# EAGLE design act_pot_diff (EAGLE 9.5.2)

## Sheet 1 of 2
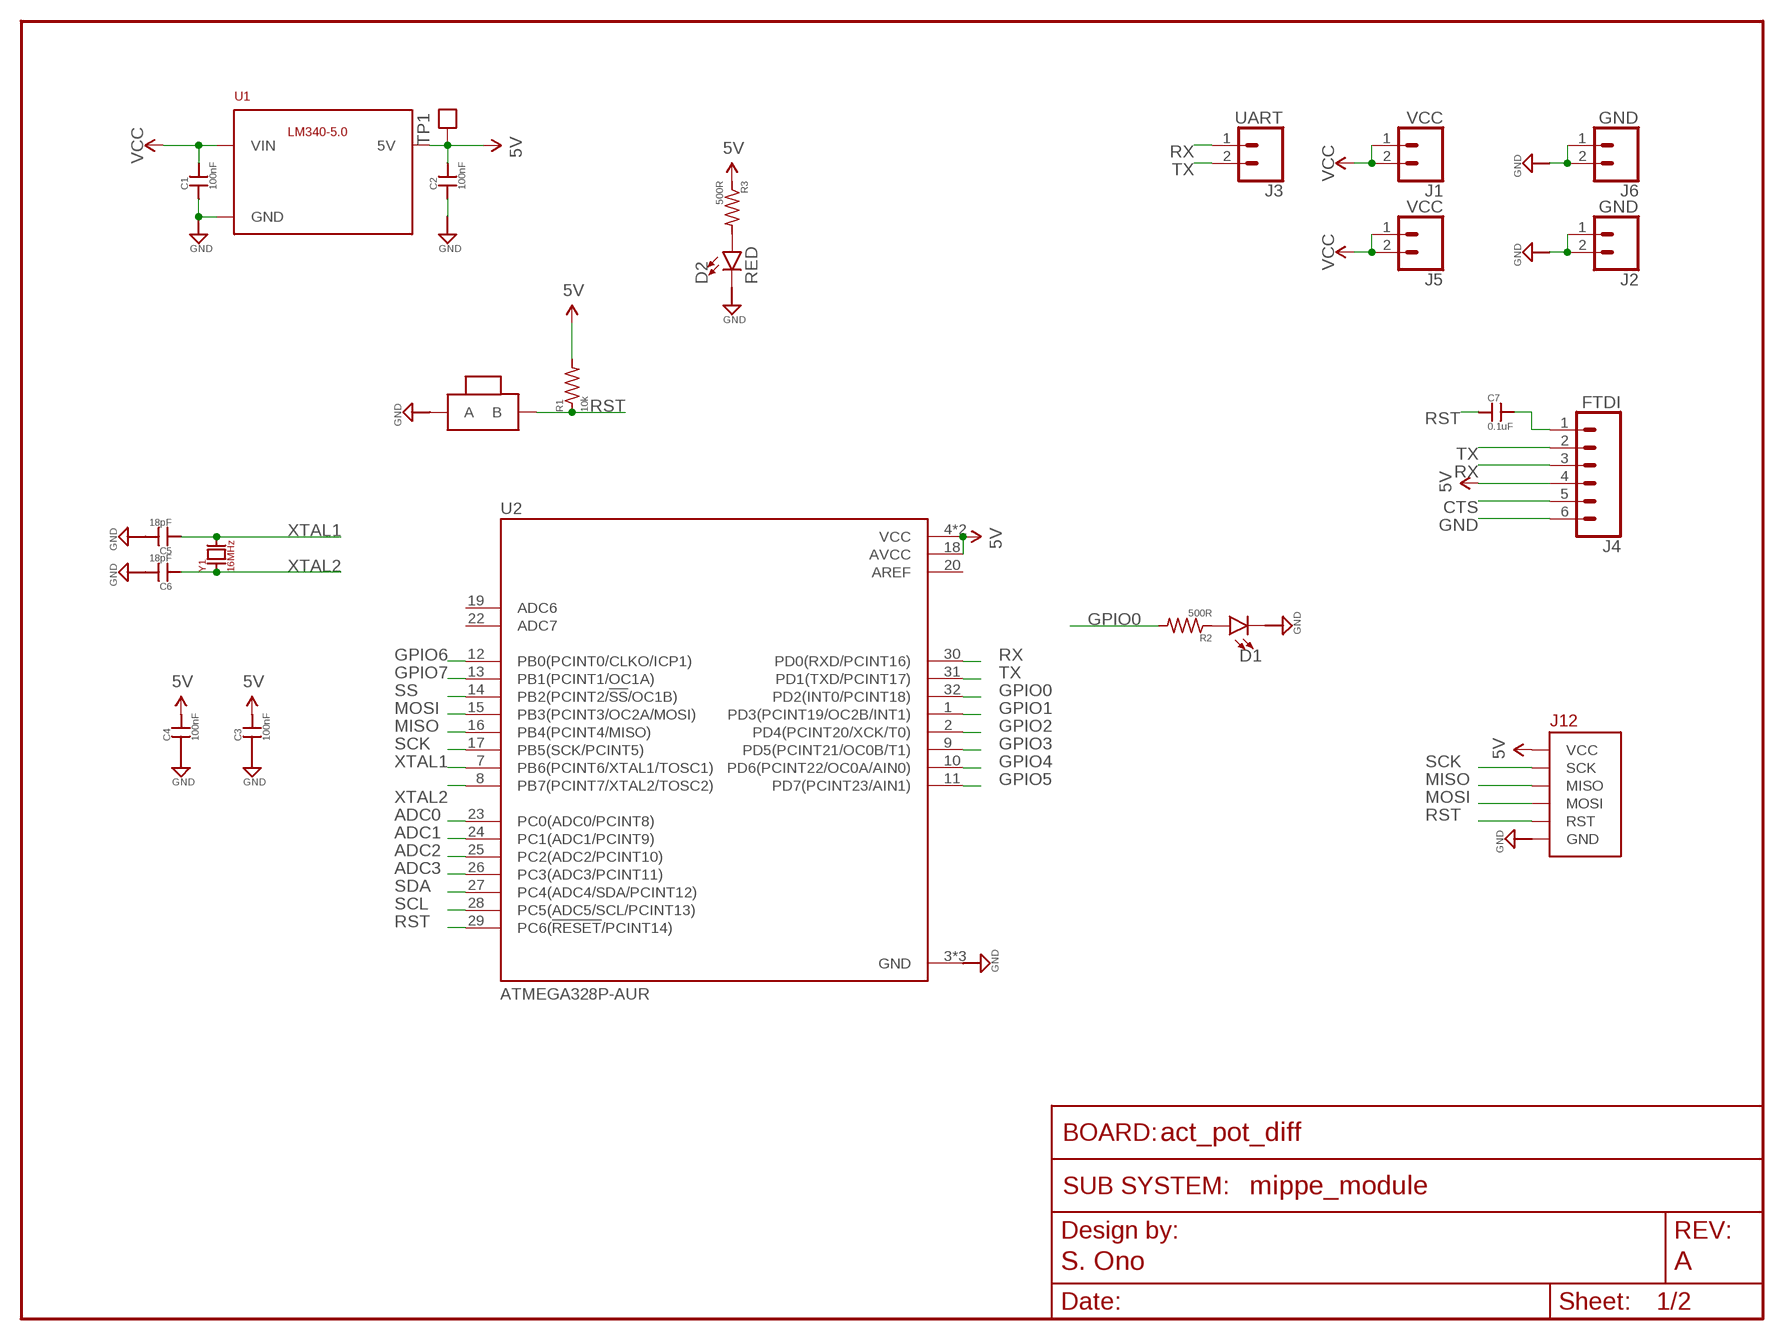
[diagram p0: schematic, sheet 1]
FRAME2 (FRAME_SCHEMATIC): AUTHOR: S. Ono; REV: A; SUBSYSTEM_NAME: mippe_module

### Parts
C1  100nF  CAP0402-CAP  [0402-CAP]
C2  100nF  CAP0402-CAP  [0402-CAP]
C3  100nF  CAP0402-CAP  [0402-CAP]
C4  100nF  CAP0402-CAP  [0402-CAP]
C5  18pF  CAP0402-CAP  [0402-CAP]
C6  18pF  CAP0402-CAP  [0402-CAP]
C7  0.1uF  CAP0402-CAP  [0402-CAP]
D1  LED0603  [LED-0603]
D2  RED  LED0603  [LED-0603]
J1  VCC  CONN_02  [1X02]
J2  GND  CONN_02  [1X02]
J3  UART  CONN_02  [1X02]
J4  FTDI  CONN_06NO_SILK_FEMALE_PTH  [1X06_NO_SILK]
J5  VCC  CONN_02  [1X02]
J6  GND  CONN_02  [1X02]
J12  BURNIN  [BURNIN]
R1  10k  R-US_R0402  [R0402]
R2  500R  R-US_R0402  [R0402]
R3  500R  R-US_R0402  [R0402]
SW1  BTN-PTS810  [BTN_PTS810]
TP1  TEST_POINTTHRU  [TEST_POINT]
U1  LM340MPX-5.0230  [SOT230P700X180-4N]
U2  ATMEGA328P-AUR  [QFP80P900X900X120-32N]
Y1  16MHz  CRYSTAL_SMOL  [XTAL500X320X130N]

### Nets
5V: C2.2 C3.2 C4.2 J4.4 J12.3.3V(VCC) R1.2 R3.1 TP1.1 U1.3(5V) U2.4(VCC) U2.6(VCC) U2.18(AVCC) ; also sheet 2
ADC0: U2.23(PC0(ADC0/PCINT8))
ADC1: U2.24(PC1(ADC1/PCINT9))
ADC2: U2.25(PC2(ADC2/PCINT10))
ADC3: U2.26(PC3(ADC3/PCINT11))
CTS: J4.5
GND: C1.1 C2.1 C3.1 C4.1 C5.2 C6.2 D1.C D2.C J2.1 J2.2 J4.6 J6.1 J6.2 J12.GND SW1.1(A) SW1.2(A) U1.2(GND) U1.4(GND) U2.3(GND) U2.5(GND) U2.21(GND) ; also sheet 2
GPIO0: R2.2 U2.32(PD2(INT0/PCINT18))
GPIO1: U2.1(PD3(PCINT19/OC2B/INT1))
GPIO2: U2.2(PD4(PCINT20/XCK/T0))
GPIO3: U2.9(PD5(PCINT21/OC0B/T1))
GPIO4: U2.10(PD6(PCINT22/OC0A/AIN0))
GPIO5: U2.11(PD7(PCINT23/AIN1))
GPIO6: U2.12(PB0(PCINT0/CLKO/ICP1))
GPIO7: U2.13(PB1(PCINT1/OC1A))
MISO: J12.MISO U2.16(PB4(PCINT4/MISO))
MOSI: J12.MOSI U2.15(PB3(PCINT3/OC2A/MOSI))
N$3: D1.A R2.1
N$4: D2.A R3.2
N$5: C7.2 J4.1
RST: C7.1 J12.RST R1.1 SW1.3(B) SW1.4(B) U2.29(PC6(!RESET!/PCINT14))
RX: J3.1 J4.3 U2.30(PD0(RXD/PCINT16))
SCK: J12.SCK U2.17(PB5(SCK/PCINT5))
SCL: U2.28(PC5(ADC5/SCL/PCINT13)) ; also sheet 2
SDA: U2.27(PC4(ADC4/SDA/PCINT12)) ; also sheet 2
SS: U2.14(PB2(PCINT2/!SS!/OC1B))
TX: J3.2 J4.2 U2.31(PD1(TXD/PCINT17))
VCC: C1.2 J1.1 J1.2 J5.1 J5.2 U1.1(VIN)
XTAL1: C5.1 U2.7(PB6(PCINT6/XTAL1/TOSC1)) Y1.2(B)
XTAL2: C6.1 U2.8(PB7(PCINT7/XTAL2/TOSC2)) Y1.1(A)
Unconnected: U2.19(ADC6) U2.22(ADC7)

## Sheet 2 of 2
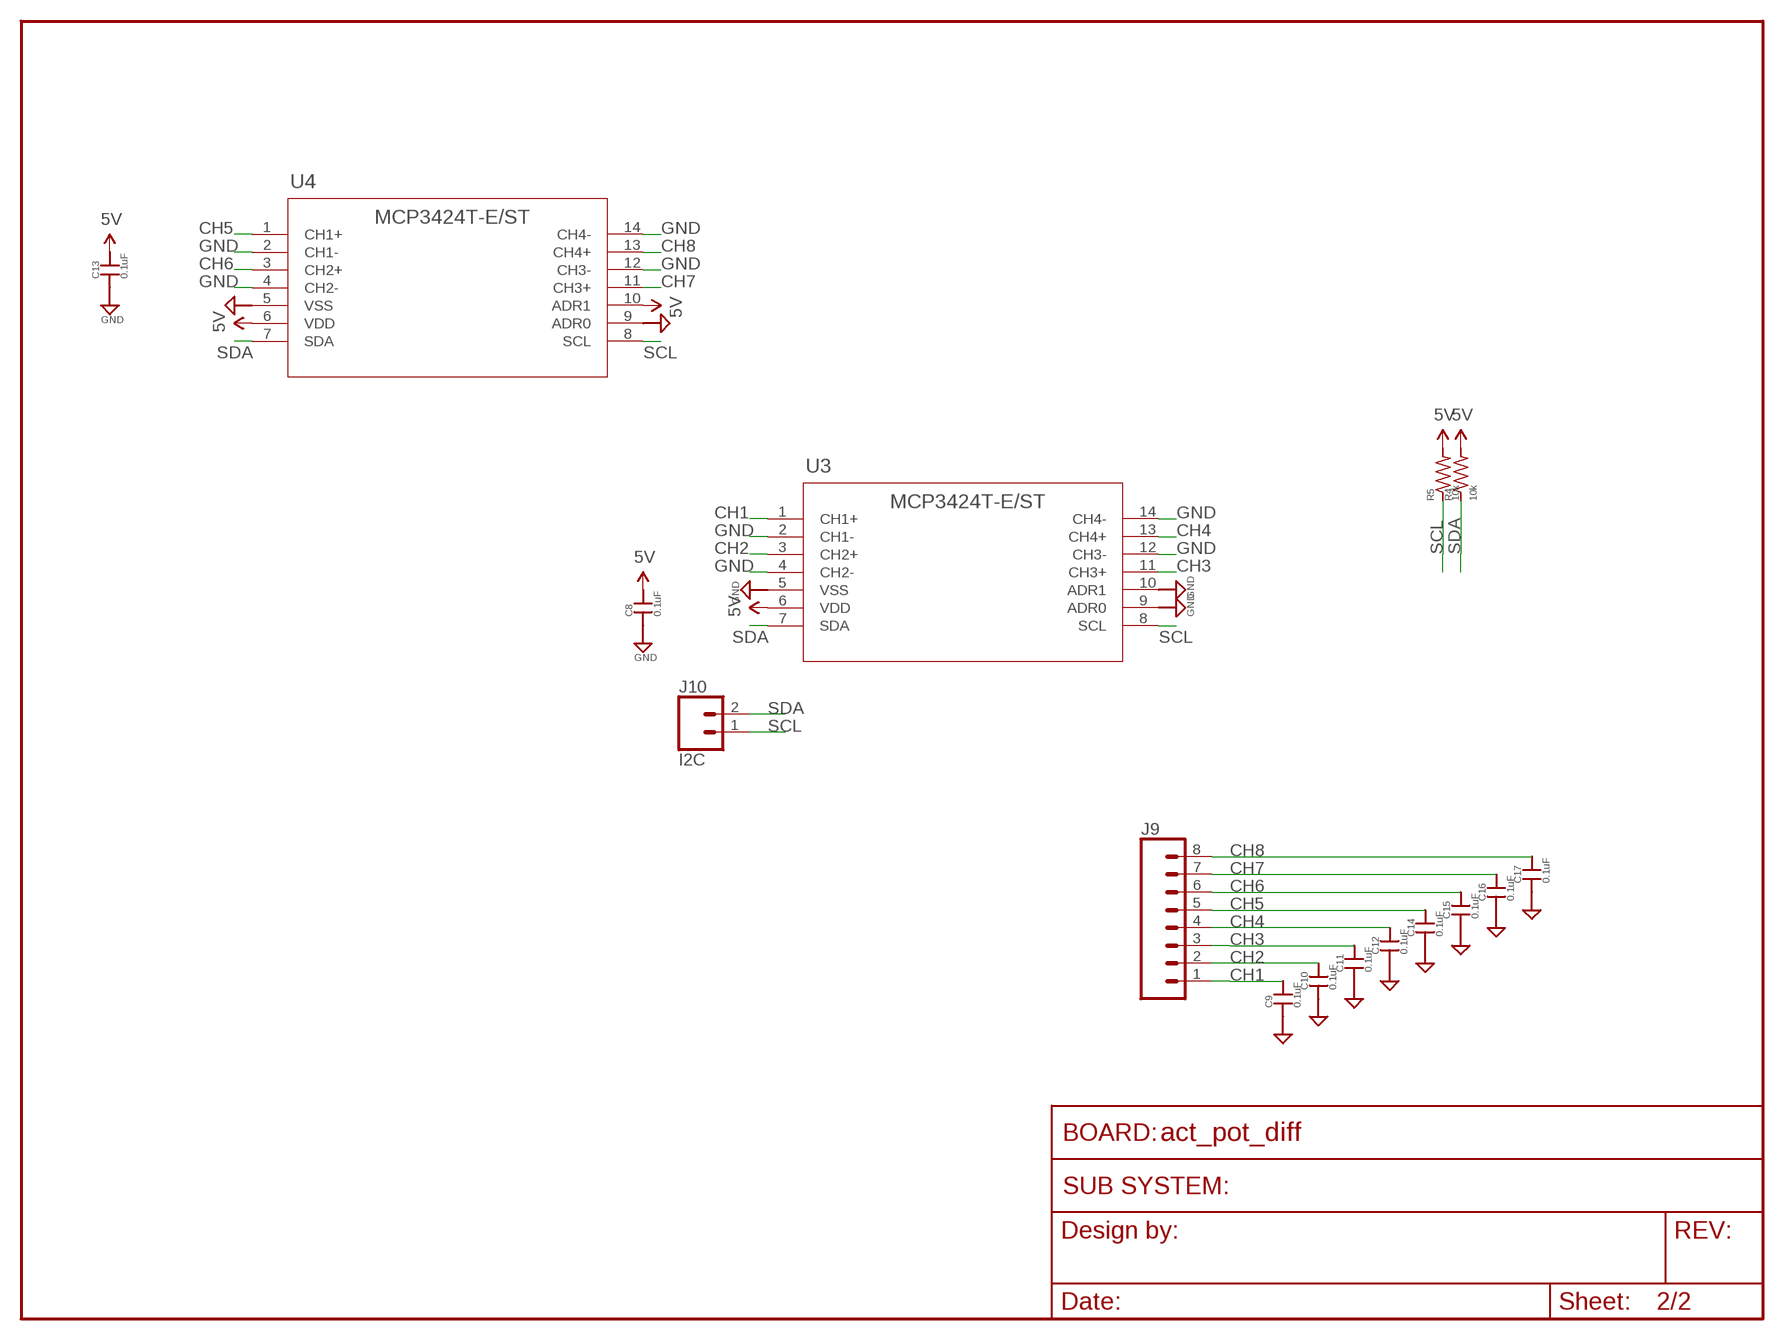
[diagram p1: schematic, sheet 2]

### Parts
C8  0.1uF  CAP0603-CAP  [0603-CAP]
C9  0.1uF  CAP0402-CAP  [0402-CAP]
C10  0.1uF  CAP0402-CAP  [0402-CAP]
C11  0.1uF  CAP0402-CAP  [0402-CAP]
C12  0.1uF  CAP0402-CAP  [0402-CAP]
C13  0.1uF  CAP0603-CAP  [0603-CAP]
C14  0.1uF  CAP0402-CAP  [0402-CAP]
C15  0.1uF  CAP0402-CAP  [0402-CAP]
C16  0.1uF  CAP0402-CAP  [0402-CAP]
C17  0.1uF  CAP0402-CAP  [0402-CAP]
J9  CONN_08"  [1X08]
J10  I2C  CONN_02  [1X02]
R4  10k  R-US_R0402  [R0402]
R5  10k  R-US_R0402  [R0402]
U3  MCP3424T-E/ST  [TSSOP14_MC]
U4  MCP3424T-E/ST  [TSSOP14_MC]

### Nets
5V: C8.2 C13.2 R4.2 R5.2 U3.6(VDD) U4.6(VDD) U4.10(ADR1) ; also sheet 1
CH1: C9.2 J9.1 U3.1(CH1+)
CH2: C10.2 J9.2 U3.3(CH2+)
CH3: C11.2 J9.3 U3.11(CH3+)
CH4: C12.2 J9.4 U3.13(CH4+)
CH5: C14.2 J9.5 U4.1(CH1+)
CH6: C15.2 J9.6 U4.3(CH2+)
CH7: C16.2 J9.7 U4.11(CH3+)
CH8: C17.2 J9.8 U4.13(CH4+)
GND: C8.1 C9.1 C10.1 C11.1 C12.1 C13.1 C14.1 C15.1 C16.1 C17.1 U3.2(CH1-) U3.4(CH2-) U3.5(VSS) U3.9(ADR0) U3.10(ADR1) U3.12(CH3-) U3.14(CH4-) U4.2(CH1-) U4.4(CH2-) U4.5(VSS) U4.9(ADR0) U4.12(CH3-) U4.14(CH4-) ; also sheet 1
SCL: J10.1 R5.1 U3.8(SCL) U4.8(SCL) ; also sheet 1
SDA: J10.2 R4.1 U3.7(SDA) U4.7(SDA) ; also sheet 1

## Power pins joined to a net without a drawn wire
AREF: U2.20(AREF)

## Library data of the parts
C1-C17 = scono:CAP: Capacitor Standard 0603 ceramic capacitor, and 0.1" leaded capacitor.; PIE-INT-REF-NUM: CAPACITOR-GENERIC
D1 D2 = scono:LED: https://www.digikey.com/products/en/optoelectronics/led-indication-discrete/105?k=&pkeyword=&pv7=2&pv1989=0&pv16=5&FV=ffe00069&quantity=0&ColumnSort=0&page=1&pageSize=25
J1-J3 J5 J6 J10 = scono:CONN_02: Multi connection point. Often used as Generic Header-pin footprint for 0.1 inch spaced/style header connections On any of the 0.1 inch spaced packages, you can populate with these: Break Away Headers - Straight <https://www.sparkfun.com/products/116> (PRT-00116) Break Away Male Headers - Right Angle <https://www.sparkfun.com/products/553> (PRT-00553) Female Headers <https://www.sparkfun.com/products/115> (PRT-00115) Break Away Headers - Machine Pin <https://www.sparkfun.com/products/117> (PRT-00117) Break Away Female Headers - Swiss Machine Pin <https://www.sparkfun.com/products/743> (PRT-00743) For SCREWTERMINALS and SPRING TERMINALS visit here: Screw Terimnals on SparkFun.com <https://www.sparkfun.com/search/results?term=Screw+Terminals> (5mm/3.5mm/2.54mm spacing) This device is also useful as a general connection point to wire up your design to another part of your project. Our various solder wires solder well into these plated through hole pads. Hook-Up Wire - Assortment (Stranded, 22 AWG) <https://www.sparkfun.com/products/11375> (PRT-11375) Hook-Up Wire - Assortment (Solid Core, 22 AWG) <https://www.sparkfun.com/products/11367> (PRT-11367) View the entire wire category on our website here <https://www.sparkfun.com/categories/141> Special notes: Molex polarized connector foot print use with: PRT-08233 with associated crimp pins and housings. 2.54_SCREWTERM for use with PRT-10571. 3.5mm Screw Terminal footprints for PRT-08084 5mm Screw Terminal footprints for use with PRT-08432
J4 = scono:CONN_06: Multi connection point. Often used as Generic Header-pin footprint for 0.1 inch spaced/style header connections On any of the 0.1 inch spaced packages, you can populate with these: Break Away Headers - Straight <https://www.sparkfun.com/products/116> (PRT-00116) Break Away Male Headers - Right Angle <https://www.sparkfun.com/products/553> (PRT-00553) Female Headers <https://www.sparkfun.com/products/115> (PRT-00115) Break Away Headers - Machine Pin <https://www.sparkfun.com/products/117> (PRT-00117) Break Away Female Headers - Swiss Machine Pin <https://www.sparkfun.com/products/743> (PRT-00743) Arduino Stackable Header - 6 Pin <https://www.sparkfun.com/products/9280> (PRT-09280) For SCREWTERMINALS and SPRING TERMINALS visit here: Screw Terimnals on SparkFun.com <https://www.sparkfun.com/search/results?term=Screw+Terminals> (5mm/3.5mm/2.54mm spacing) This device is also useful as a general connection point to wire up your design to another part of your project. Our various solder wires solder well into these plated through hole pads. Hook-Up Wire - Assortment (Stranded, 22 AWG) <https://www.sparkfun.com/products/11375> (PRT-11375) Hook-Up Wire - Assortment (Solid Core, 22 AWG) <https://www.sparkfun.com/products/11367> (PRT-11367) View the entire wire category on our website here <https://www.sparkfun.com/categories/141>; PROD_ID: CONN-08437
J9 = scono:CONN_08: Multi connection point. Often used as Generic Header-pin footprint for 0.1 inch spaced/style header connections On any of the 0.1 inch spaced packages, you can populate with these: Break Away Headers - Straight <https://www.sparkfun.com/products/116> (PRT-00116) Break Away Male Headers - Right Angle <https://www.sparkfun.com/products/553> (PRT-00553) Female Headers <https://www.sparkfun.com/products/115> (PRT-00115) Break Away Headers - Machine Pin <https://www.sparkfun.com/products/117> (PRT-00117) Break Away Female Headers - Swiss Machine Pin <https://www.sparkfun.com/products/743> (PRT-00743) Arduino Stackable Header - 8 Pin <https://www.sparkfun.com/products/9279> (PRT-09279) For SCREWTERMINALS and SPRING TERMINALS visit here: Screw Terimnals on SparkFun.com <https://www.sparkfun.com/search/results?term=Screw+Terminals> (5mm/3.5mm/2.54mm spacing) This device is also useful as a general connection point to wire up your design to another part of your project. Our various solder wires solder well into these plated through hole pads. Hook-Up Wire - Assortment (Stranded, 22 AWG) <https://www.sparkfun.com/products/11375> (PRT-11375) Hook-Up Wire - Assortment (Solid Core, 22 AWG) <https://www.sparkfun.com/products/11367> (PRT-11367) View the entire wire category on our website here <https://www.sparkfun.com/categories/141> Special notes: Molex polarized connector foot print use with SKU : PRT-08231 with associated crimp pins and housings. 1MM SMD Version SKU: PRT-10208 NOTES ON THE VARIANTS LOCK and LOCK_LONGPADS... This footprint was designed to help hold the alignment of a through-hole component (i.e. 6-pin header) while soldering it into place. You may notice that each hole has been shifted either up or down by 0.005 of an inch from it's more standard position (which is a perfectly straight line). This slight alteration caused the pins (the squares in the middle) to touch the edges of the holes. Because they are alternating, it causes a "brace" to hold the component in place. 0.005 has proven to be the perfect amount of "off-center" position when using our standard breakaway headers. Although looks a little odd when you look at the bare footprint, once you have a header in there, the alteration is very hard to notice. Also,if you push a header all the way into place, it is covered up entirely on the bottom side.; PROD_ID: CONN-08438
J12 = scono:BURNIN
R1-R5 = scono:R-US_: RESISTOR, American symbol
SW1 = scono:BTN-PTS810: https://www.digikey.com/product-detail/en/c-k/PTS810-SJM-250-SMTR-LFS/CKN10502CT-ND/4176673
TP1 = scono:TEST_POINT: 1206 Test point for O-scope probes. For A106146CT-ND or similar
U1 = scono:LM340MPX-5.0
U2 = scono:ATMEGA328P-AUR: ATmega328P Series 8 Bit 2 kB RAM 32 kB Flash SMT Microcontroller - TQFP-32; DESCRIPTION: ATmega328P Series 8 Bit 2 kB RAM 32 kB Flash SMT Microcontroller - TQFP-32; DIGI-KEY_PART_NUMBER: ATMEGA328P-AURCT-ND; DIGI-KEY_PURCHASE_URL: https://www.digikey.com/product-detail/en/microchip-technology/ATMEGA328P-AUR/ATMEGA328P-AURCT-ND/3789455?utm_source=snapeda&utm_medium=aggregator&utm_campaign=symbol; MF: Microchip; MP: ATMEGA328P-AUR; PACKAGE: TQFP-32 Microchip
U3 U4 = scono:MCP3424T-E/ST; MANUFACTURER_PART_NUMBER: MCP3424TEST; VENDOR: Microchip
Y1 = scono:CRYSTAL

## Board
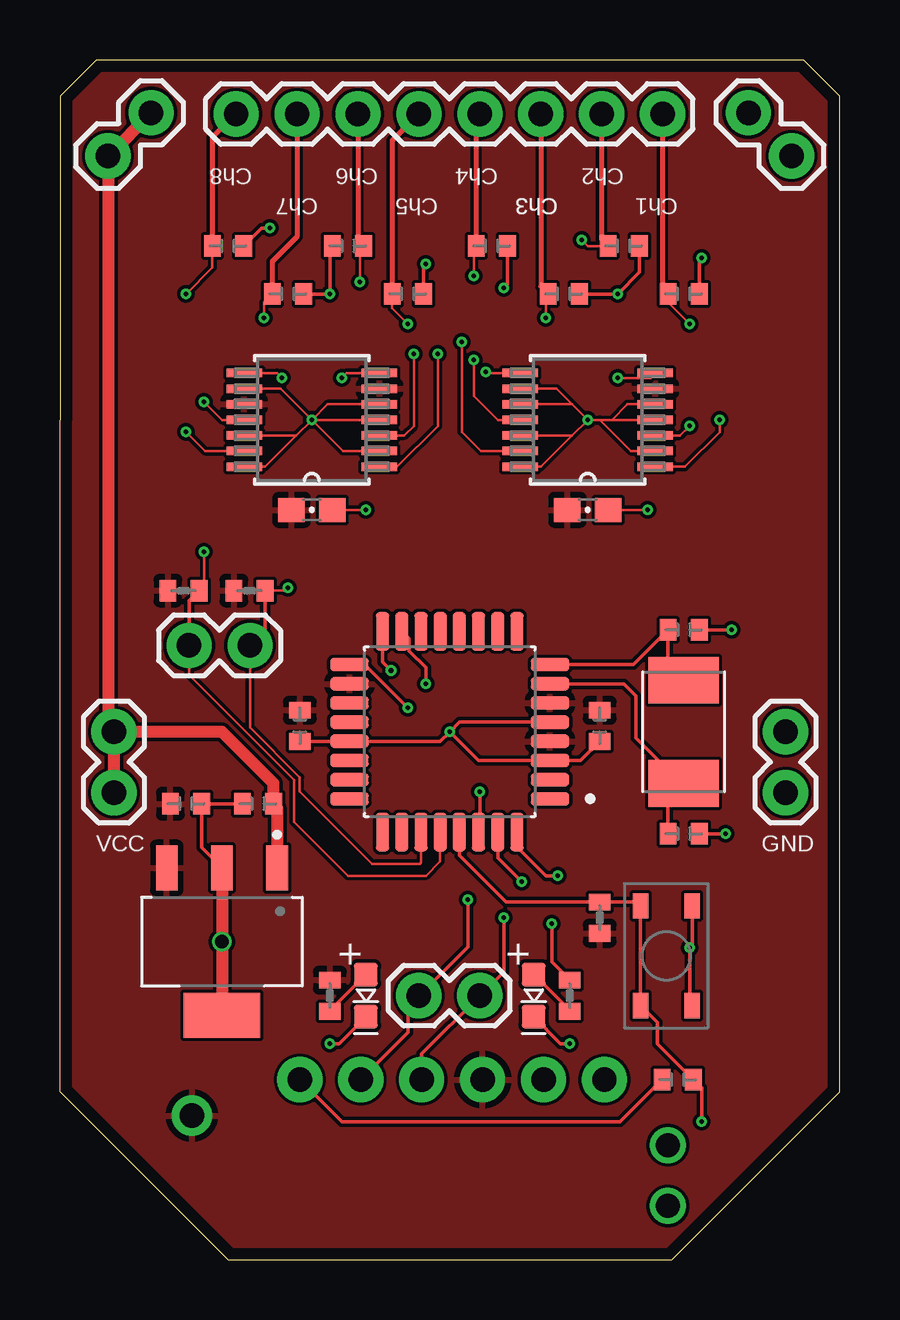
[diagram p2: board, top side]
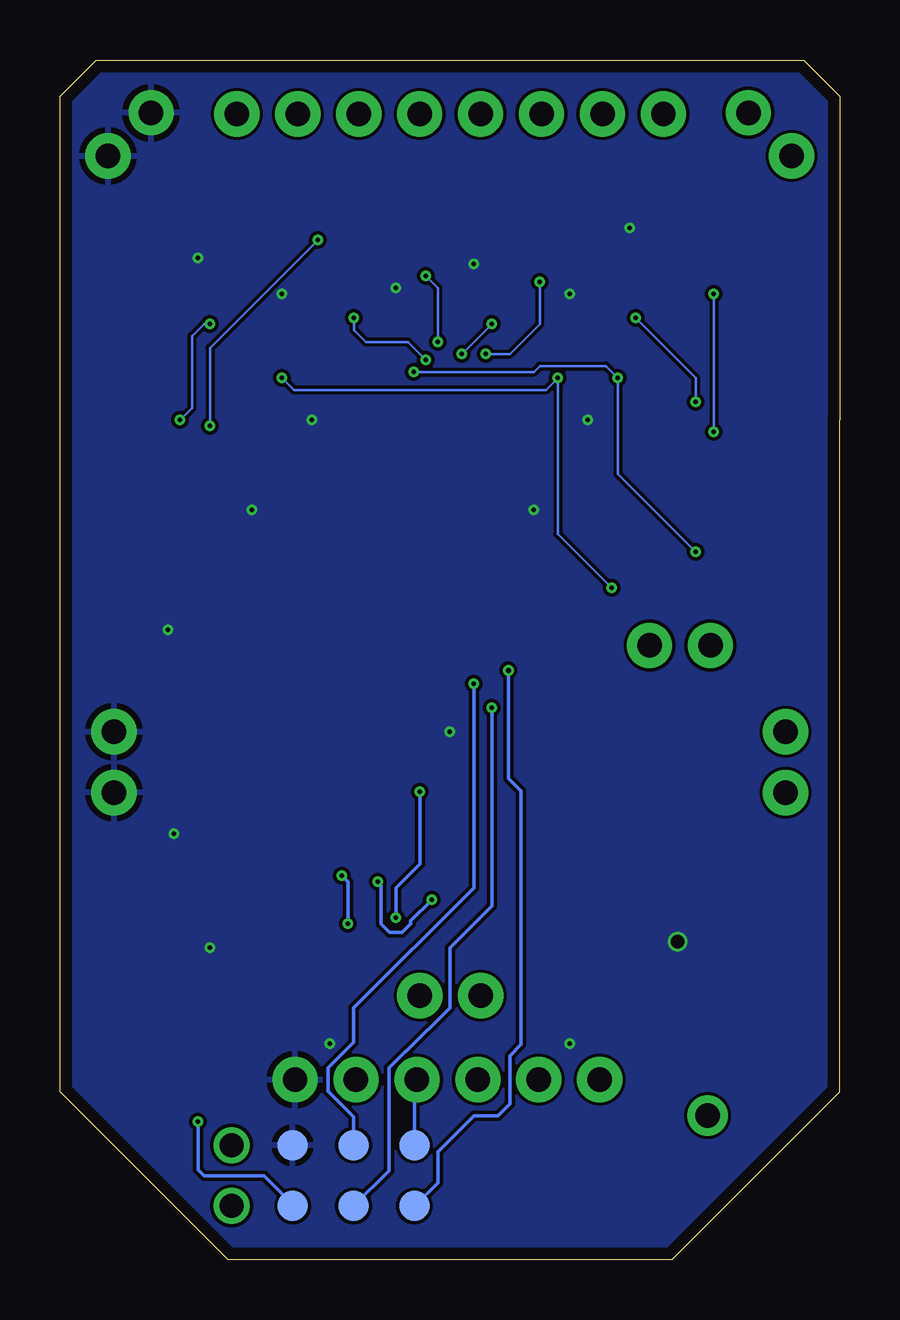
[diagram p3: board, bottom side, seen from below]

Size 32.5 x 50 mm. Coordinates in mm from the lower left corner, seen from the top.
Outline: 7,0 0,7 0,35 0,48.5 1.5,50 31,50 32.5,48.5 32.5,30.5 32.5,7 25.5,0 7,0
Copper layers (1*16): Top 2mil / dielectric 9mil / Bottom 2mil
Design rules "scono *": minimum track width 3.5mil, minimum drill 0.2mm, track to track 5.5mil, track to pad 5.5mil, pad to pad 5.5mil, via to via 5.5mil, smd to smd 0mil, copper to edge 0.5mm, drill to drill 0.5mm, minimum pad ring 0.125mm, minimum via ring 0.125mm, stop-mask expansion 3mil, vias tented up to drill 0mil, thermal gap 10mil

### Footprints (pad centres in the part's own frame; a part is rotated, then mirrored left to right if it is on the bottom)
0402-CAP = smd 0.7 x 0.9: 1 -0.65,0; 2 0.65,0
0603-CAP = smd 1.1 x 1: 1 -0.85,0; 2 0.85,0
LED-0603 = smd 1 x 1: A 0.877,0; C -0.877,0
1X02 = drill 1.016 pad 1.88: 1 0,0; 2 2.54,0
1X06_NO_SILK = drill 1.016 pad 1.88: 1 0,0; 2 2.54,0; 3 5.08,0; 4 7.62,0; 5 10.16,0; 6 12.7,0
1X08 = drill 1.016 pad 1.88: 1 0,0; 2 2.54,0; 3 5.08,0; 4 7.62,0; 5 10.16,0; 6 12.7,0; 7 15.24,0; 8 17.78,0
BURNIN = smd 1.27 x 1.27 bottom: 3.3V 0,0; GND -5.08,0; MISO 0,2.54; MOSI -2.54,0; RST -5.08,2.54; SCK -2.54,2.54 | drill 1: P$7 -7.62,2.54; P$8 -7.62,0
R0402 = smd 0.7 x 0.9: 1 -0.65,0; 2 0.65,0
BTN_PTS810 = smd 1.05 x 0.65: 1 -2.075,1.075; 2 2.075,1.075; 3 -2.075,-1.075; 4 2.075,-1.075
TEST_POINT = drill 1.016 pad 1.676: 1 0,0
SOT230P700X180-4N = smd 1.86 x 0.9: 1 -3.075,2.3; 2 -3.075,0; 3 -3.075,-2.3 | smd 1.86 x 3.19: 4 3.075,0
QFP80P900X900X120-32N = smd 1.6 x 0.55: 1 -4.18,2.8; 2 -4.18,2; 3 -4.18,1.2; 4 -4.18,0.4; 5 -4.18,-0.4; 6 -4.18,-1.2; 7 -4.18,-2; 8 -4.18,-2.8; 17 4.18,-2.8; 18 4.18,-2; 19 4.18,-1.2; 20 4.18,-0.4; 21 4.18,0.4; 22 4.18,1.2; 23 4.18,2; 24 4.18,2.8 | smd 0.55 x 1.6: 9 -2.8,-4.18; 10 -2,-4.18; 11 -1.2,-4.18; 12 -0.4,-4.18; 13 0.4,-4.18; 14 1.2,-4.18; 15 2,-4.18; 16 2.8,-4.18; 25 2.8,4.18; 26 2,4.18; 27 1.2,4.18; 28 0.4,4.18; 29 -0.4,4.18; 30 -1.2,4.18; 31 -2,4.18; 32 -2.8,4.18
TSSOP14_MC = smd 1.473 x 0.356: 1 -2.819,1.95; 2 -2.819,1.3; 3 -2.819,0.65; 4 -2.819,0; 5 -2.819,-0.65; 6 -2.819,-1.3; 7 -2.819,-1.95; 8 2.819,-1.95; 9 2.819,-1.3; 10 2.819,-0.65; 11 2.819,0; 12 2.819,0.65; 13 2.819,1.3; 14 2.819,1.95
XTAL500X320X130N = smd 1.95 x 2.95: 1 -2.15,0; 2 2.15,0

### Placement (x,y rotation side)
C1  8.25,19 0 top
C2  5.25,19 180 top
C3  10,22.25 90 top
C4  22.5,22.25 90 top
C5  26,17.75 0 top
C6  26,26.25 0 top
C7  25.75,7.5 180 top
C8  10.5,31.25 180 top
C9  26,40.25 180 top
C10  23.5,42.25 180 top
C11  21,40.25 180 top
C12  18,42.25 180 top
C13  22,31.25 180 top
C14  14.5,40.25 180 top
C15  12,42.25 0 top
C16  9.5,40.25 180 top
C17  7,42.25 180 top
D1  19.75,11 90 top
D2  12.75,11 90 top
J1  2.25,22 270 top
J2  30.25,22 270 top
J3  17.5,11 180 top
J4  10,7.5 0 top
J5  2,46 45 top
J6  30.5,46 135 top
J9  25.12,47.75 180 top
J10  5.38,25.6 0 top
J12  17.72,4.77 180 top
R1  22.5,14.25 270 top
R2  21.25,11 90 top
R3  11.25,11 270 top
R4  7.9,27.88 180 top
R5  5.15,27.88 180 top
SW1  25.28,12.66 270 top
TP1  5.5,6 0 top
U1  6.75,13.25 270 top
U2  16.25,22 180 top
U3  22,35 180 top
U4  10.5,35 180 top
Y1  26,22 270 top

### Tracks (layer width: path | path; a pad name or v marks a point on that pad's centre or on a via)
5V
  Bottom 0.152: J12.3.3V 17.72,7.4 J4.4
  pour Top: 36.75,-1.25 -7.75,-1.25 -7.75,50.75 36.75,50.75
CH1  (via drill 0.2)
  Top 0.1: U3.1 26.05,33.05 27.5,34.5 v27.5,35 | v26.25,39 25.35,39.9 C9.2
  Top 0.2: J9.1 25.12,40.48 C9.2
  Bottom 0.1: v27.5,35 27,35.5 27,38.5 26.5,39 v26.25,39
CH2  (via drill 0.2)
  Top 0.1: U3.3 25.85,34.35 v26.25,34.75 | C10.2 22,42.25 v21.75,42.5
  Top 0.2: J9.2 22.58,42.52 C10.2
  Bottom 0.1: v21.75,42.5 26.25,38 v26.25,34.75
CH3  (via drill 0.2)
  Top 0.1: U3.11 18.25,35 17.25,36 v17.25,37.5 | v20.25,39.25 20.25,40.15 C11.2
  Top 0.2: J9.3 20.04,40.56 C11.2
  Bottom 0.1: v20.25,39.25 20.25,38.75 19.75,38.25 18,38.25 v17.25,37.5
CH4  (via drill 0.2)
  Top 0.1: U3.13 17.55,33.7 16.75,34.5 v16.75,38.25 | v17.25,41 17.25,42.15 C12.2
  Top 0.2: J9.4 17.35,47.6 C12.2
  Bottom 0.1: v16.75,38.25 16.75,40.5 v17.25,41
CH5  (via drill 0.2)
  Top 0.1: U4.1 14.05,33.05 15.75,34.75 v15.75,37.75 | v14.5,39 13.85,39.65 C14.2
  Top 0.2: J9.5 13.85,46.64 C14.2
  Bottom 0.1: v15.75,37.75 v14.5,39
CH6  (via drill 0.2)
  Top 0.1: U4.3 14.35,34.35 14.75,34.75 v14.75,37.75 | v12.5,40.75 12.5,42.1 C15.2
  Top 0.2: J9.6 12.42,42.48 C15.2
  Bottom 0.1: v12.5,40.75 12.5,39 13.75,37.75 v14.75,37.75
CH7  (via drill 0.2)
  Top 0.1: v6,35.75 6.75,35 U4.11 | v8.5,39.25 8.5,39.9 C16.2
  Top 0.2: J9.7 9.88,42.63 8.85,41.6 C16.2
  Bottom 0.1: v6,35.75 6,36.75 v8.5,39.25
CH8  (via drill 0.2)
  Top 0.1: C17.2 6.35,41.35 v5.25,40.25 | U4.13 6.05,33.7 v5.25,34.5
  Top 0.2: J9.8 6.35,46.76 C17.2
  Bottom 0.1: v5.25,40.25 v5.25,34.5
GND  (via drill 0.2, 0.55)
  Top 0.1: v12.75,31.25 C8.1 | v24.5,31.25 C13.1 | U4.9 9.2,36.3 v10.5,35 | U4.12 9.85,34.35 | 9.85,34.35 v10.5,35 | U4.14 8.55,33.05 9.85,34.35 | U4.2 11.8,33.7 v10.5,35 | U4.4 v10.5,35 | U4.5 11.15,35.65 v10.5,35 | U3.10 21.35,35.65 | 21.35,35.65 v22,35 | U3.9 20.7,36.3 21.35,35.65 | U3.12 21.35,34.35 | 21.35,34.35 v22,35 | U3.14 20.05,33.05 21.35,34.35 | v22,35 22.5,35 | U3.2 23.8,33.7 22.5,35 | 22.5,35 U3.4 | v22,35 23,35 23.65,35.65 U3.5
  Top 0.152: U1.2 5.9,17.18 C2.1 C1.1 | C3.1 U2.21 15.85,21.6 v16.25,22 | C6.2 v28,26.25 | C4.1 21.7,20.8 U2.3 17.45,20.8 v16.25,22 | U2.5 16.65,22.4 v16.25,22 | C5.2 v27.75,17.75 | SW1.1 26.36,13.11 v26.25,13 26.25,10.69 SW1.2 | D1.C 20.87,9 v21.25,9 | D2.C 11.63,9 v11.25,9 | C17.1 8.4,43 v8.75,43 | C16.1 v11.25,40.25 11.25,42.15 C15.1 | C14.1 15.15,41.4 v15.25,41.5 | C12.1 18.65,40.65 v18.5,40.5 | C11.1 v23.25,40.25 24.15,41.15 C10.1 | C9.1 26.65,41.65 v26.75,41.75
  Top 0.508: U1.2 v6.75,13.25 U1.4
  pour Bottom: 36.75,-1.25 -7.75,-1.25 -7.75,50.75 36.75,50.75
GPIO0  (via drill 0.2)
  Top 0.152: R2.2 20.5,12.4 v20.5,14 | v20.75,16 20.25,16 19.05,17.2 U2.32
  Bottom 0.152: v20.5,14 20.5,15.75 v20.75,16
MISO  (via drill 0.2)
  Top 0.152: U2.16 13.45,24.91 v13.8,24.55
  Bottom 0.152: v13.8,24.55 13.8,20.05 13.38,19.62 13.28,19.53 13.28,8.97 13.75,8.5 13.75,6.5 14.25,6 15.25,6 16.75,4.5 16.75,3.2 J12.MISO
MOSI  (via drill 0.2)
  Top 0.152: U2.15 14.55,25.88 14.55,25.37 15.25,24.67 v15.25,24
  Bottom 0.152: J12.MOSI 20.26,5.95 21.33,7.02 21.33,7.98 20.26,9.05 20.26,10.49 15.25,15.5 v15.25,24
N$3
  Top 0.152: D1.A 21.25,10.38 R2.1
N$4
  Top 0.152: D2.A 11.25,10.38 R3.2
N$5
  Top 0.152: J4.1 11.75,5.75 23.35,5.75 C7.2
RST  (via drill 0.2)
  Top 0.152: 24.09,14.85 24.04,14.9 R1.1 18.6,14.9 16.65,16.85 U2.29 | 24.09,14.85 SW1.3 | SW1.3 SW1.4 24.9,9.89 24.9,9 C7.1 26.75,7.15 v26.75,5.75 | SW1.3 24.09,14.85
  Bottom 0.152: J12.RST 22.8,2.3 24,3.5 26.5,3.5 26.75,3.75 v26.75,5.75
RX  (via drill 0.2)
  Top 0.152: v17.5,19.5 17.5,17.87 U2.30 | v18.5,14.25 18.5,12 J3.1 15.08,8.58 J4.3
  Bottom 0.152: v18.5,14.25 18.5,15.5 17.5,16.5 v17.5,19.5
SCK  (via drill 0.2)
  Top 0.152: U2.17 12.7,24.8 v14.5,23
  Bottom 0.152: J12.SCK 18.79,3.7 18.79,7.98 18.1,8.67 18.08,8.67 16.25,10.5 16.25,13 14.5,14.75 v14.5,23
SCL  (via drill 0.2)
  Top 0.1: U2.28 15.85,16.6 15.25,16 12,16 9.75,18.25 9.75,20 5.38,24.37 J10.1 | U4.8 9.05,36.95 v9.25,36.75 | v6,29.5 6,28.08 R5.1 | U3.8 17.8,36.95 v17.75,37
  Top 0.152: J10.1 5.38,27.46 R5.1
  Bottom 0.1: v6,29.5 9.25,32.75 v9.25,36.75 9.75,37.25 12.5,37.25 12.75,37 v17.75,37
SDA  (via drill 0.2)
  Top 0.1: U2.27 15.05,16.55 15,16.5 13,16.5 9.99,19.51 9.99,20.1 7.92,22.17 J10.2 | U4.7 11.95,36.95 v11.75,36.75 | v9.5,28 9.38,27.88 R4.1 | v23.25,36.75 24.62,36.75 U3.7
  Top 0.152: R4.1 8.55,26.23 J10.2
  Bottom 0.1: v9.5,28 11.75,30.25 v11.75,36.75 12.25,36.25 19.5,36.25 22.75,36.25 v23.25,36.75
TX  (via drill 0.2)
  Top 0.152: v19.25,15.75 18.25,16.75 U2.31 | J4.2 14.5,9.46 14.5,10.54 J3.2 17,13.04 v17,15
  Bottom 0.152: v19.25,15.75 19.11,15.61 19.11,14 18.75,13.64 18.25,13.64 17.89,14 17.89,14.11 v17,15
VCC
  Top 0.508: U1.1 9.05,18.85 C1.2 8.9,19.85 6.75,22 J1.1 | J1.2 J1.1 | J5.2 J5.1 2,22.25 J1.1
XTAL1
  Top 0.152: U2.7 23.5,24 24,23.5 24,21.75 25.9,19.85 Y1.2 25.35,19.2 C5.1
XTAL2
  Top 0.152: U2.8 23.9,24.8 C6.1 25.35,24.8 Y1.1

### Text on the board
tPlace: Ch8 | Ch6 | Ch4 | Ch2 | Ch7 | Ch5 | Ch3 | Ch3 | Ch3 | Ch1 | VCC | GND